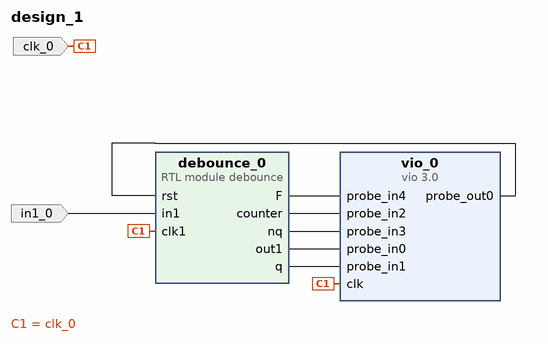
[diagram p0: block diagram of the top level]
# Vivado block design design_1, xc7s50csga324-1, Vivado 2025.2
create_bd_design design_1

create_bd_port -dir I -type clk clk_0
create_bd_port -dir I in1_0

create_bd_cell -type ip -vlnv xilinx.com:ip:vio:3.0 vio_0
set_property -dict [list \
  CONFIG.C_NUM_PROBE_IN 5 \
  CONFIG.C_NUM_PROBE_OUT 1 \
  CONFIG.C_PROBE_IN1_WIDTH 2 \
  CONFIG.C_PROBE_IN2_WIDTH 27 \
  CONFIG.C_PROBE_IN3_WIDTH 2 \
] [get_bd_cells vio_0]
create_bd_cell -type module -reference debounce debounce_0

# ---- connections ----

connect_bd_net -net clk_0_1 [get_bd_ports clk_0] [get_bd_pins vio_0/clk] [get_bd_pins debounce_0/clk1]
connect_bd_net [get_bd_pins debounce_0/F] [get_bd_pins vio_0/probe_in4]
connect_bd_net [get_bd_pins debounce_0/counter] [get_bd_pins vio_0/probe_in2]
connect_bd_net [get_bd_pins debounce_0/nq] [get_bd_pins vio_0/probe_in3]
connect_bd_net [get_bd_pins debounce_0/out1] [get_bd_pins vio_0/probe_in0]
connect_bd_net [get_bd_pins debounce_0/q] [get_bd_pins vio_0/probe_in1]
connect_bd_net -net in1_0_1 [get_bd_ports in1_0] [get_bd_pins debounce_0/in1]
connect_bd_net [get_bd_pins vio_0/probe_out0] [get_bd_pins debounce_0/rst]

validate_bd_design
save_bd_design
